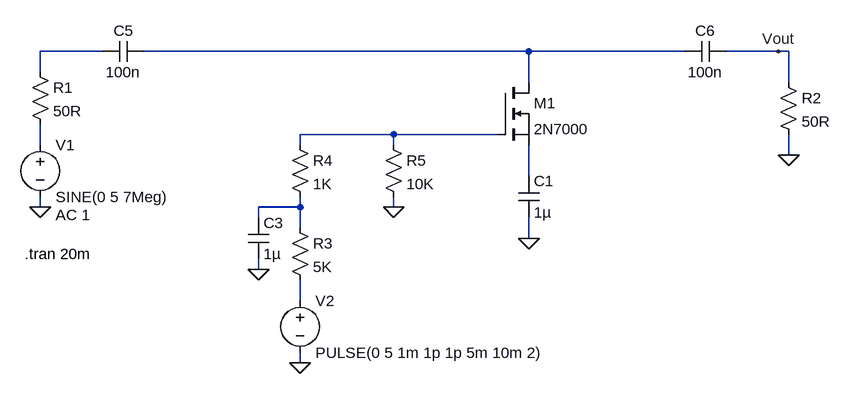
[diagram p0: schematic Raised Cosine BFO Testing.asc]
Raised Cosine BFO Testing.asc, the LTspice schematic file:
Version 4
SHEET 1 1224 836
WIRE -384 0 -480 0
WIRE 272 0 -320 0
WIRE 512 0 272 0
WIRE 656 0 576 0
WIRE 672 0 656 0
WIRE -480 32 -480 0
WIRE 272 48 272 0
WIRE 672 48 672 0
WIRE 64 128 -80 128
WIRE 224 128 64 128
WIRE -480 144 -480 112
WIRE -80 144 -80 128
WIRE 64 144 64 128
WIRE 672 160 672 128
WIRE 272 192 272 144
WIRE -480 240 -480 224
WIRE -80 240 -80 224
WIRE -80 240 -144 240
WIRE 64 240 64 224
WIRE -144 256 -144 240
WIRE -80 272 -80 240
WIRE 272 288 272 256
WIRE -144 336 -144 320
WIRE -80 384 -80 352
WIRE -80 480 -80 464
FLAG 672 160 0
FLAG 64 240 0
FLAG -80 480 0
FLAG -480 240 0
FLAG 656 0 Vout
FLAG -144 336 0
FLAG 272 288 0
SYMBOL voltage -480 128 R0
WINDOW 123 24 124 Left 2
WINDOW 39 0 0 Left 2
SYMATTR Value2 AC 1
SYMATTR InstName V1
SYMATTR Value SINE(0 5 7Meg)
SYMBOL voltage -80 368 R0
WINDOW 123 0 0 Left 2
WINDOW 39 0 0 Left 2
SYMATTR InstName V2
SYMATTR Value PULSE(0 5 1m 1p 1p 5m 10m 2)
SYMBOL res -496 16 R0
SYMATTR InstName R1
SYMATTR Value 50R
SYMBOL res 656 32 R0
SYMATTR InstName R2
SYMATTR Value 50R
SYMBOL res -96 256 R0
SYMATTR InstName R3
SYMATTR Value 5K
SYMBOL res -96 128 R0
SYMATTR InstName R4
SYMATTR Value 1K
SYMBOL res 48 128 R0
SYMATTR InstName R5
SYMATTR Value 10K
SYMBOL cap -160 256 R0
SYMATTR InstName C3
SYMATTR Value 1µ
SYMBOL nmos 224 48 R0
SYMATTR InstName M1
SYMATTR Value 2N7000
SYMBOL cap -320 -16 R90
WINDOW 0 0 32 VBottom 2
WINDOW 3 32 32 VTop 2
SYMATTR InstName C5
SYMATTR Value 100n
SYMBOL cap 576 -16 R90
WINDOW 0 0 32 VBottom 2
WINDOW 3 32 32 VTop 2
SYMATTR InstName C6
SYMATTR Value 100n
SYMBOL cap 256 192 R0
SYMATTR InstName C1
SYMATTR Value 1µ
TEXT -504 312 Left 2 !.tran 20m

The netlist it stands for:
* Raised Cosine BFO Testing.asc
V1 N004 0 SINE(0 5 7Meg) AC 1
V2 N007 0 PULSE(0 5 1m 1p 1p 5m 10m 2)
R1 N001 N004 50R
R2 Vout 0 50R
R3 N006 N007 5K
R4 N003 N006 1K
R5 N003 0 10K
C3 N006 0 1µ
M1 N002 N003 N005 N005 2N7000
C5 N002 N001 100n
C6 Vout N002 100n
C1 N005 0 1µ
.model NMOS NMOS
.model PMOS PMOS
.lib standard.mos
.tran 20m
.backanno
.end